# Altium schematic sheet Sh_Connect.SchDoc
size A3
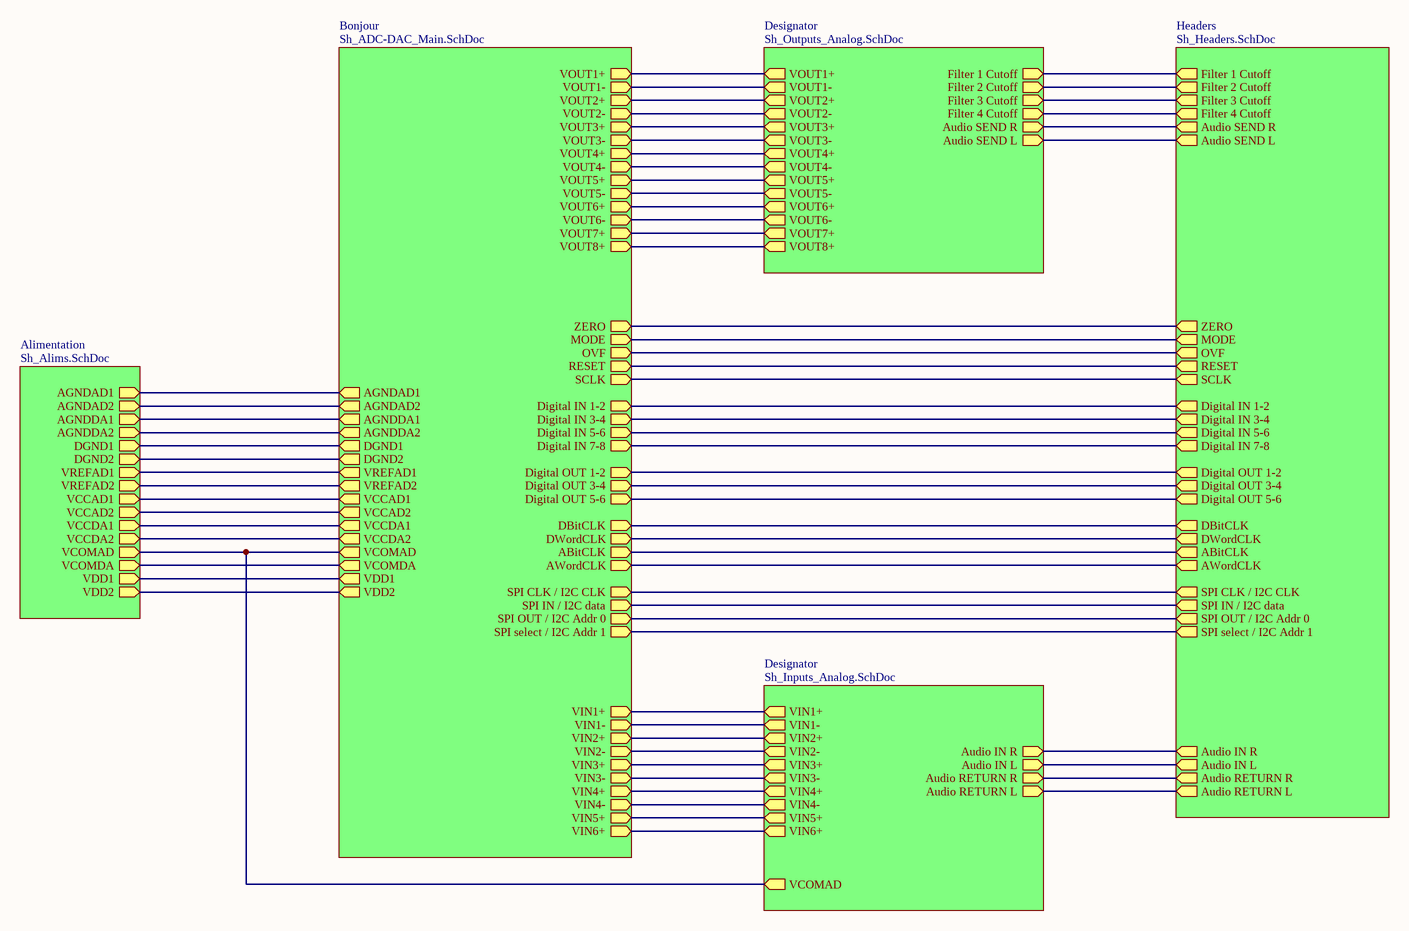
[diagram p0: Sh_Connect.SchDoc]

## Sub-sheets
Alimentation = Sh_Alims.SchDoc: AGNDAD1 (out), AGNDAD2 (out), AGNDDA1 (out), AGNDDA2 (out), DGND1 (out), DGND2 (out), VREFAD1 (out), VREFAD2 (out), VCCAD1 (out), VCCAD2 (out), VCCDA1 (out), VCCDA2 (out), VCOMAD (out), VCOMDA (out), VDD1 (out), VDD2 (out)
Bonjour = Sh_ADC-DAC_Main.SchDoc: VOUT1+ (out), VOUT1- (out), VOUT2+ (out), VOUT2- (out), VOUT3+ (out), VOUT3- (out), VOUT4+ (out), VOUT4- (out), VOUT5+ (out), VOUT5- (out), VOUT6+ (out), VOUT6- (out), VOUT7+ (out), VOUT8+ (out), AGNDAD1 (out), AGNDAD2 (out), AGNDDA1 (out), AGNDDA2 (out), DGND1 (out), DGND2 (out), VREFAD1 (out), VREFAD2 (out), VCCAD1 (out), VCCAD2 (out), VCCDA1 (out), VCCDA2 (out), VCOMAD (out), VCOMDA (out), VDD1 (out), VDD2 (out), ZERO (out), MODE (out), OVF (out), RESET (out), SCLK (out), Digital IN 1-2 (out), Digital IN 3-4 (out), Digital IN 5-6 (out), Digital IN 7-8 (out), Digital OUT 1-2 (out), Digital OUT 3-4 (out), Digital OUT 5-6 (out), DBitCLK (out), DWordCLK (out), ABitCLK (out), AWordCLK (out), SPI CLK / I2C CLK (out), SPI IN / I2C data (out), SPI OUT / I2C Addr 0 (out), SPI select / I2C Addr 1 (out), VIN1+ (out), VIN1- (out), VIN2+ (out), VIN2- (out), VIN3+ (out), VIN3- (out), VIN4+ (out), VIN4- (out), VIN5+ (out), VIN6+ (out)
Designator = Sh_Outputs_Analog.SchDoc: VOUT1+ (out), VOUT1- (out), VOUT2+ (out), VOUT2- (out), VOUT3+ (out), VOUT3- (out), VOUT4+ (out), VOUT4- (out), VOUT5+ (out), VOUT5- (out), VOUT6+ (out), VOUT6- (out), VOUT7+ (out), VOUT8+ (out), Filter 1 Cutoff (out), Filter 2 Cutoff (out), Filter 3 Cutoff (out), Filter 4 Cutoff (out), Audio SEND R (out), Audio SEND L (out)
Designator = Sh_Inputs_Analog.SchDoc: VCOMAD (out), VIN1+ (out), VIN1- (out), VIN2+ (out), VIN2- (out), VIN3+ (out), VIN3- (out), VIN4+ (out), VIN4- (out), VIN5+ (out), VIN6+ (out), Audio IN R (out), Audio IN L (out), Audio RETURN R (out), Audio RETURN L (out)
Headers = Sh_Headers.SchDoc: Filter 1 Cutoff (out), Filter 2 Cutoff (out), Filter 3 Cutoff (out), Filter 4 Cutoff (out), Audio SEND R (out), Audio SEND L (out), Audio IN R (out), Audio IN L (out), Audio RETURN R (out), Audio RETURN L (out), ZERO (out), MODE (out), OVF (out), RESET (out), SCLK (out), Digital IN 1-2 (out), Digital IN 3-4 (out), Digital IN 5-6 (out), Digital IN 7-8 (out), Digital OUT 1-2 (out), Digital OUT 3-4 (out), Digital OUT 5-6 (out), DBitCLK (out), DWordCLK (out), ABitCLK (out), AWordCLK (out), SPI CLK / I2C CLK (out), SPI IN / I2C data (out), SPI OUT / I2C Addr 0 (out), SPI select / I2C Addr 1 (out)

## Nets
(unnamed): sheet Bonjour/VOUT1+, sheet Designator/VOUT1+
(unnamed): sheet Bonjour/VOUT1-, sheet Designator/VOUT1-
(unnamed): sheet Bonjour/VOUT2+, sheet Designator/VOUT2+
(unnamed): sheet Bonjour/VOUT2-, sheet Designator/VOUT2-
(unnamed): sheet Bonjour/VOUT3+, sheet Designator/VOUT3+
(unnamed): sheet Bonjour/VOUT3-, sheet Designator/VOUT3-
(unnamed): sheet Bonjour/VOUT4+, sheet Designator/VOUT4+
(unnamed): sheet Bonjour/VOUT4-, sheet Designator/VOUT4-
(unnamed): sheet Bonjour/VOUT5+, sheet Designator/VOUT5+
(unnamed): sheet Bonjour/VOUT5-, sheet Designator/VOUT5-
(unnamed): sheet Bonjour/VOUT6+, sheet Designator/VOUT6+
(unnamed): sheet Bonjour/VOUT6-, sheet Designator/VOUT6-
(unnamed): sheet Bonjour/VOUT7+, sheet Designator/VOUT7+
(unnamed): sheet Bonjour/VOUT8+, sheet Designator/VOUT8+
(unnamed): sheet Bonjour/AGNDAD1, sheet Alimentation/AGNDAD1
(unnamed): sheet Bonjour/AGNDAD2, sheet Alimentation/AGNDAD2
(unnamed): sheet Bonjour/AGNDDA1, sheet Alimentation/AGNDDA1
(unnamed): sheet Bonjour/AGNDDA2, sheet Alimentation/AGNDDA2
(unnamed): sheet Bonjour/DGND1, sheet Alimentation/DGND1
(unnamed): sheet Bonjour/DGND2, sheet Alimentation/DGND2
(unnamed): sheet Bonjour/VREFAD1, sheet Alimentation/VREFAD1
(unnamed): sheet Bonjour/VREFAD2, sheet Alimentation/VREFAD2
(unnamed): sheet Bonjour/VCCAD1, sheet Alimentation/VCCAD1
(unnamed): sheet Bonjour/VCCAD2, sheet Alimentation/VCCAD2
(unnamed): sheet Bonjour/VCCDA1, sheet Alimentation/VCCDA1
(unnamed): sheet Bonjour/VCCDA2, sheet Alimentation/VCCDA2
(unnamed): sheet Bonjour/VCOMAD, sheet Alimentation/VCOMAD, sheet Designator/VCOMAD
(unnamed): sheet Bonjour/VCOMDA, sheet Alimentation/VCOMDA
(unnamed): sheet Bonjour/VDD1, sheet Alimentation/VDD1
(unnamed): sheet Bonjour/VDD2, sheet Alimentation/VDD2
(unnamed): sheet Bonjour/ZERO, sheet Headers/ZERO
(unnamed): sheet Bonjour/MODE, sheet Headers/MODE
(unnamed): sheet Bonjour/OVF, sheet Headers/OVF
(unnamed): sheet Bonjour/RESET, sheet Headers/RESET
(unnamed): sheet Bonjour/SCLK, sheet Headers/SCLK
(unnamed): sheet Bonjour/Digital IN 1-2, sheet Headers/Digital IN 1-2
(unnamed): sheet Bonjour/Digital IN 3-4, sheet Headers/Digital IN 3-4
(unnamed): sheet Bonjour/Digital IN 5-6, sheet Headers/Digital IN 5-6
(unnamed): sheet Bonjour/Digital IN 7-8, sheet Headers/Digital IN 7-8
(unnamed): sheet Bonjour/Digital OUT 1-2, sheet Headers/Digital OUT 1-2
(unnamed): sheet Bonjour/Digital OUT 3-4, sheet Headers/Digital OUT 3-4
(unnamed): sheet Bonjour/Digital OUT 5-6, sheet Headers/Digital OUT 5-6
(unnamed): sheet Bonjour/DBitCLK, sheet Headers/DBitCLK
(unnamed): sheet Bonjour/DWordCLK, sheet Headers/DWordCLK
(unnamed): sheet Bonjour/ABitCLK, sheet Headers/ABitCLK
(unnamed): sheet Bonjour/AWordCLK, sheet Headers/AWordCLK
(unnamed): sheet Bonjour/SPI CLK / I2C CLK, sheet Headers/SPI CLK / I2C CLK
(unnamed): sheet Bonjour/SPI IN / I2C data, sheet Headers/SPI IN / I2C data
(unnamed): sheet Bonjour/SPI OUT / I2C Addr 0, sheet Headers/SPI OUT / I2C Addr 0
(unnamed): sheet Bonjour/SPI select / I2C Addr 1, sheet Headers/SPI select / I2C Addr 1
(unnamed): sheet Bonjour/VIN1+, sheet Designator/VIN1+
(unnamed): sheet Bonjour/VIN1-, sheet Designator/VIN1-
(unnamed): sheet Bonjour/VIN2+, sheet Designator/VIN2+
(unnamed): sheet Bonjour/VIN2-, sheet Designator/VIN2-
(unnamed): sheet Bonjour/VIN3+, sheet Designator/VIN3+
(unnamed): sheet Bonjour/VIN3-, sheet Designator/VIN3-
(unnamed): sheet Bonjour/VIN4+, sheet Designator/VIN4+
(unnamed): sheet Bonjour/VIN4-, sheet Designator/VIN4-
(unnamed): sheet Bonjour/VIN5+, sheet Designator/VIN5+
(unnamed): sheet Bonjour/VIN6+, sheet Designator/VIN6+
(unnamed): sheet Designator/Filter 1 Cutoff, sheet Headers/Filter 1 Cutoff
(unnamed): sheet Designator/Filter 2 Cutoff, sheet Headers/Filter 2 Cutoff
(unnamed): sheet Designator/Filter 3 Cutoff, sheet Headers/Filter 3 Cutoff
(unnamed): sheet Designator/Filter 4 Cutoff, sheet Headers/Filter 4 Cutoff
(unnamed): sheet Designator/Audio SEND R, sheet Headers/Audio SEND R
(unnamed): sheet Designator/Audio SEND L, sheet Headers/Audio SEND L
(unnamed): sheet Headers/Audio IN R, sheet Designator/Audio IN R
(unnamed): sheet Headers/Audio IN L, sheet Designator/Audio IN L
(unnamed): sheet Headers/Audio RETURN R, sheet Designator/Audio RETURN R
(unnamed): sheet Headers/Audio RETURN L, sheet Designator/Audio RETURN L